# EAGLE schematic thermostat-v100 (EAGLE 6.5.0)
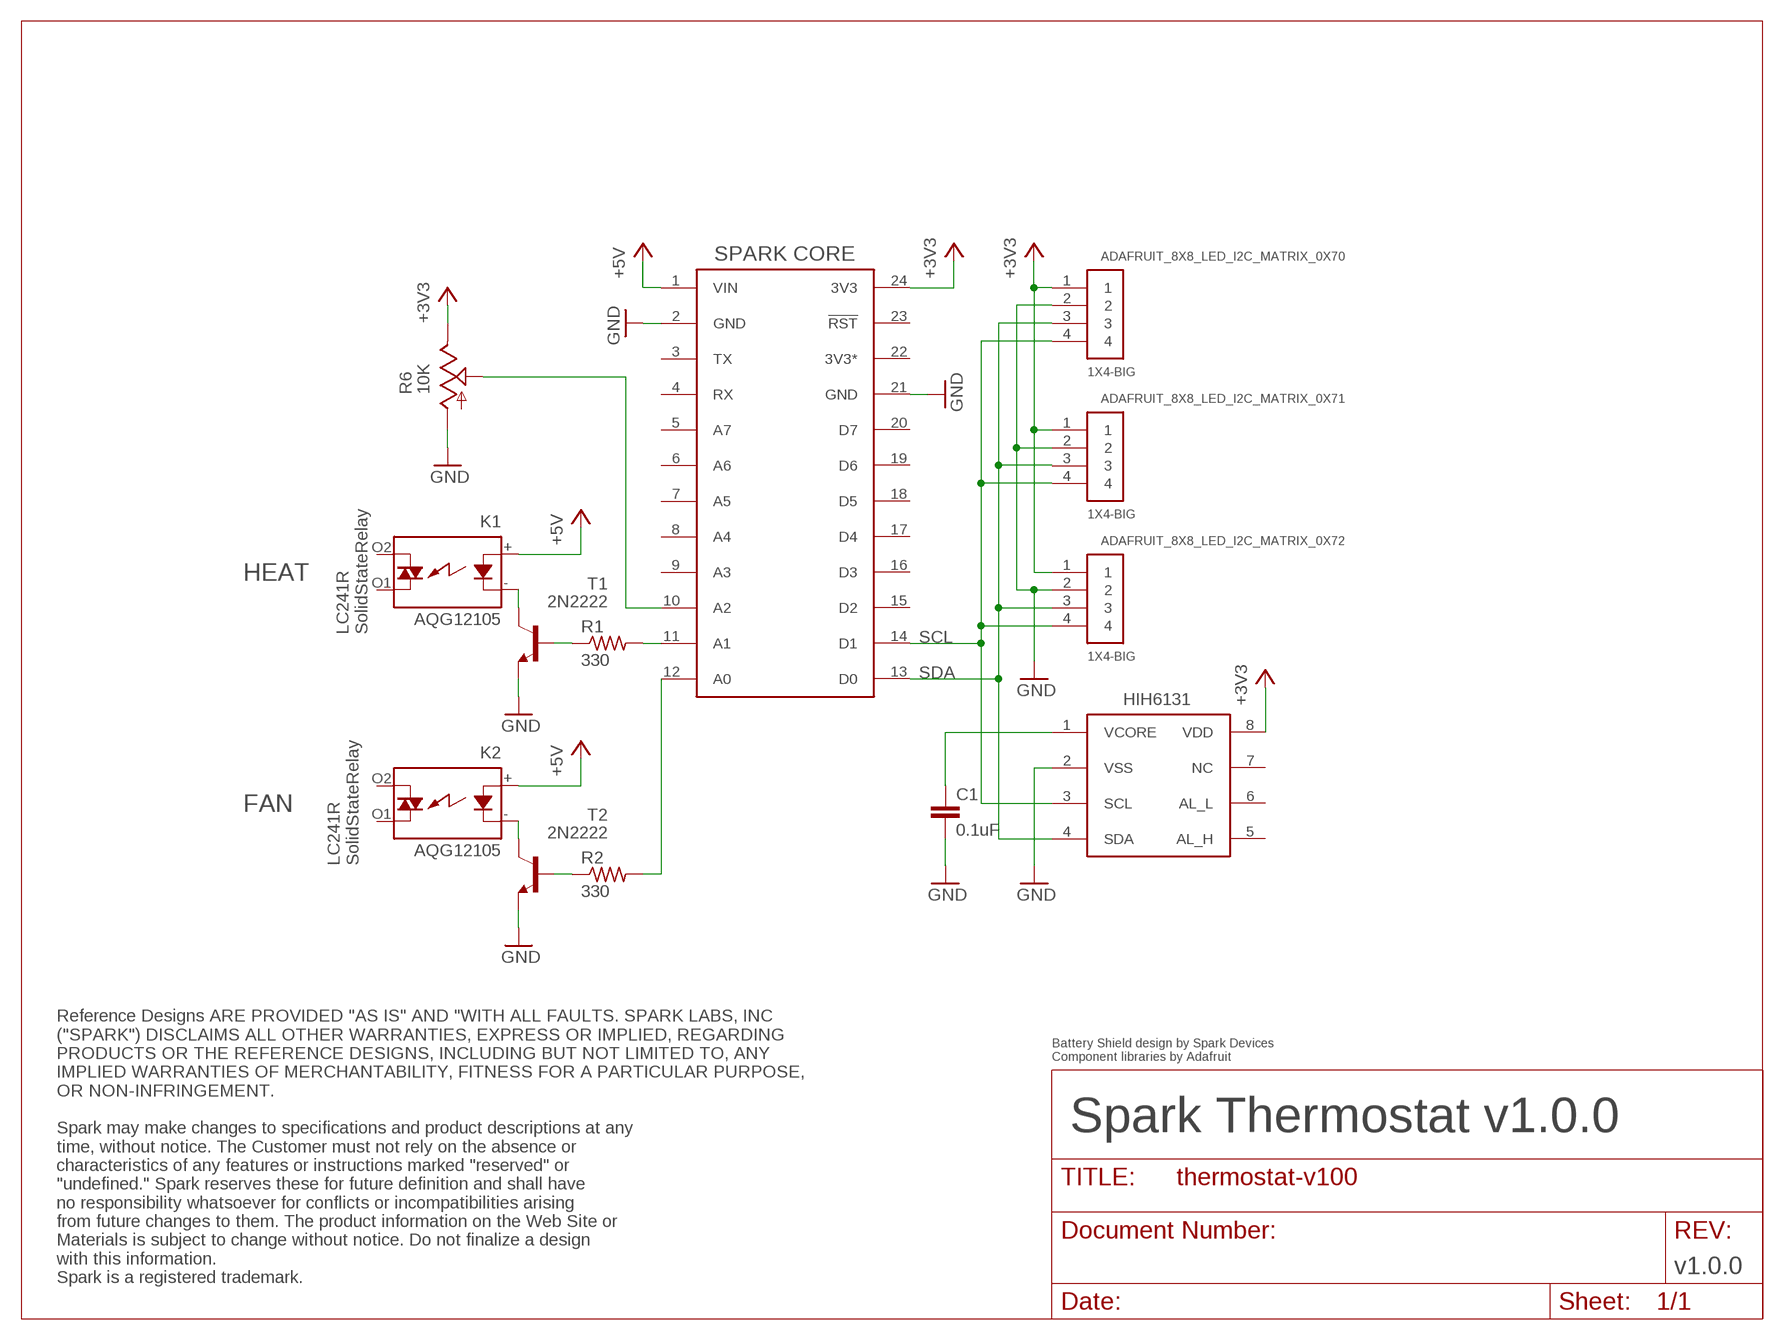
[diagram p0: schematic, sheet 1]

## Parts
ADAFRUIT_8X8_LED_I2C_MATRIX_0X70  1X4-BIG  [1X04-BIG]
ADAFRUIT_8X8_LED_I2C_MATRIX_0X71  1X4-BIG  [1X04-BIG]
ADAFRUIT_8X8_LED_I2C_MATRIX_0X72  1X4-BIG  [1X04-BIG]
C1  0.1uF  C-EU025-024X044  [C025-024X044]
HIH6131  HIH6131  [SOIC8]
K1  AQG12105  [AQG]
K2  AQG12105  [AQG]
R1  330  R-US_0207/10  [0207/10]
R2  330  R-US_0207/10  [0207/10]
R6  10K  TRIM_US-CIP20C-6MM  [CIP20C-6MM]
T1  2N2222  [TO92-EBC-OVAL]
T2  2N2222  [TO92-EBC-OVAL]
U$1  SPARK_CORECORE  [SPARK_CORE]

## Nets
+3V3: ADAFRUIT_8X8_LED_I2C_MATRIX_0X70.1 ADAFRUIT_8X8_LED_I2C_MATRIX_0X71.1 ADAFRUIT_8X8_LED_I2C_MATRIX_0X72.1 HIH6131.8(VDD) R6.E U$1.24(3V3)
+5V: K1.+(A) K2.+(A) U$1.1(VIN)
GND: ADAFRUIT_8X8_LED_I2C_MATRIX_0X70.2 ADAFRUIT_8X8_LED_I2C_MATRIX_0X71.2 ADAFRUIT_8X8_LED_I2C_MATRIX_0X72.2 C1.2 HIH6131.2(VSS) R6.A T1.E T2.E U$1.2(GND) U$1.21(GND)
N$1: R1.2 U$1.11(A1)
N$2: K1.-(K) T1.C
N$5: C1.1 HIH6131.1(VCORE)
N$6: K2.-(K) T2.C
N$7: R1.1 T1.B
N$8: R2.1 T2.B
N$9: R2.2 U$1.12(A0)
N$10: R6.S U$1.10(A2)
SCL: ADAFRUIT_8X8_LED_I2C_MATRIX_0X70.4 ADAFRUIT_8X8_LED_I2C_MATRIX_0X71.4 ADAFRUIT_8X8_LED_I2C_MATRIX_0X72.4 HIH6131.3(SCL) U$1.14(D1)
SDA: ADAFRUIT_8X8_LED_I2C_MATRIX_0X70.3 ADAFRUIT_8X8_LED_I2C_MATRIX_0X71.3 ADAFRUIT_8X8_LED_I2C_MATRIX_0X72.3 HIH6131.4(SDA) U$1.13(D0)
Unconnected: HIH6131.5(AL_H) HIH6131.6(AL_L) HIH6131.7(NC) K1.O1(DS2) K1.O2(DS1) K2.O1(DS2) K2.O2(DS1) U$1.3(TX) U$1.4(RX) U$1.5(A7) U$1.6(A6) U$1.7(A5) U$1.8(A4) U$1.9(A3) U$1.15(D2) U$1.16(D3) U$1.17(D4) U$1.18(D5) U$1.19(D6) U$1.20(D7) U$1.23(!RST)

## Notes on the sheet
- SPARK CORE
- HEAT
- LC241R
  SolidStateRelay
- HIH6131
- FAN
- LC241R
  SolidStateRelay
- Battery Shield design by Spark Devices
  Component libraries by Adafruit
- Spark Thermostat v1.0.0
- v1.0.0
- Reference Designs ARE PROVIDED "AS IS" AND "WITH ALL FAULTS. SPARK LABS, INC 
  ("SPARK") DISCLAIMS ALL OTHER WARRANTIES, EXPRESS OR IMPLIED, REGARDING 
  PRODUCTS OR THE REFERENCE DESIGNS, INCLUDING BUT NOT LIMITED TO, ANY 
  IMPLIED WARRANTIES OF MERCHANTABILITY, FITNESS FOR A PARTICULAR PURPOSE,
  OR NON-INFRINGEMENT.
  
  Spark may make changes to specifications and product descriptions at any 
  time, without notice. The Customer must not rely on the absence or 
  characteristics of any features or instructions marked "reserved" or 
  "undefined." Spark reserves these for future definition and shall have 
  no responsibility whatsoever for conflicts or incompatibilities arising 
  from future changes to them. The product information on the Web Site or 
  Materials is subject to change without notice. Do not finalize a design 
  with this information. 
  Spark is a registered trademark.

## Power pins joined to a net without a drawn wire
3V3*: U$1.22(3V3*)

## Library data of the parts
ADAFRUIT_8X8_LED_I2C_MATRIX_0X70-ADAFRUIT_8X8_LED_I2C_MATRIX_0X72 = adafruit:1X4: 4-pin connector
C1 = rcl:C-EU: CAPACITOR, European symbol
HIH6131 = Spark:HIH6131
K1 K2 = relay:AQG*: SOLID STATE RELAY NAiS Zero-cross, Non zero-cross Source: http://www.mew-europe.com/.. en_ds_61611_0000.pdf; MF: AROMAT/ MATSUSHITA; MPN: AQG12105; OC_FARNELL: unknown; OC_NEWARK: 20J4759
R1 R2 = rcl:R-US_: RESISTOR, American symbol
R6 = pot:TRIM_US-: POTENTIOMETER
T1 T2 = adafruit:2N2222: NPN TRANSISTOR Big oval pads
U$1 = Spark:SPARK_CORE